# Altium schematic sheet Ethernet.SchDoc: Dahlia Carrier Board
size A3; Organization: Toradex AG; Address1: Ebenaustrasse 10; Address2: Horw; Address3: 6048; Address4: Switzerland; DocumentNumber: 7; Revision: V1.1; SheetNumber: 7; SheetTotal: 21; PageSetup: Record=PageOptions|CenterHorizontal=True|CenterVertical=True|PrintScale=0.71|XCorrection=1.00|YCorrection=1.00|PrintKind=1|BorderSize=5000000|LeftOffset=0|BottomOffset=0|Orientation=2|PaperLength=1000|PaperWidth=1000|Scale=100|PaperSource=15|PrintQuality=600|MediaType=1|DitherType=10|PaperKind=A4|PrintScaleMode=1
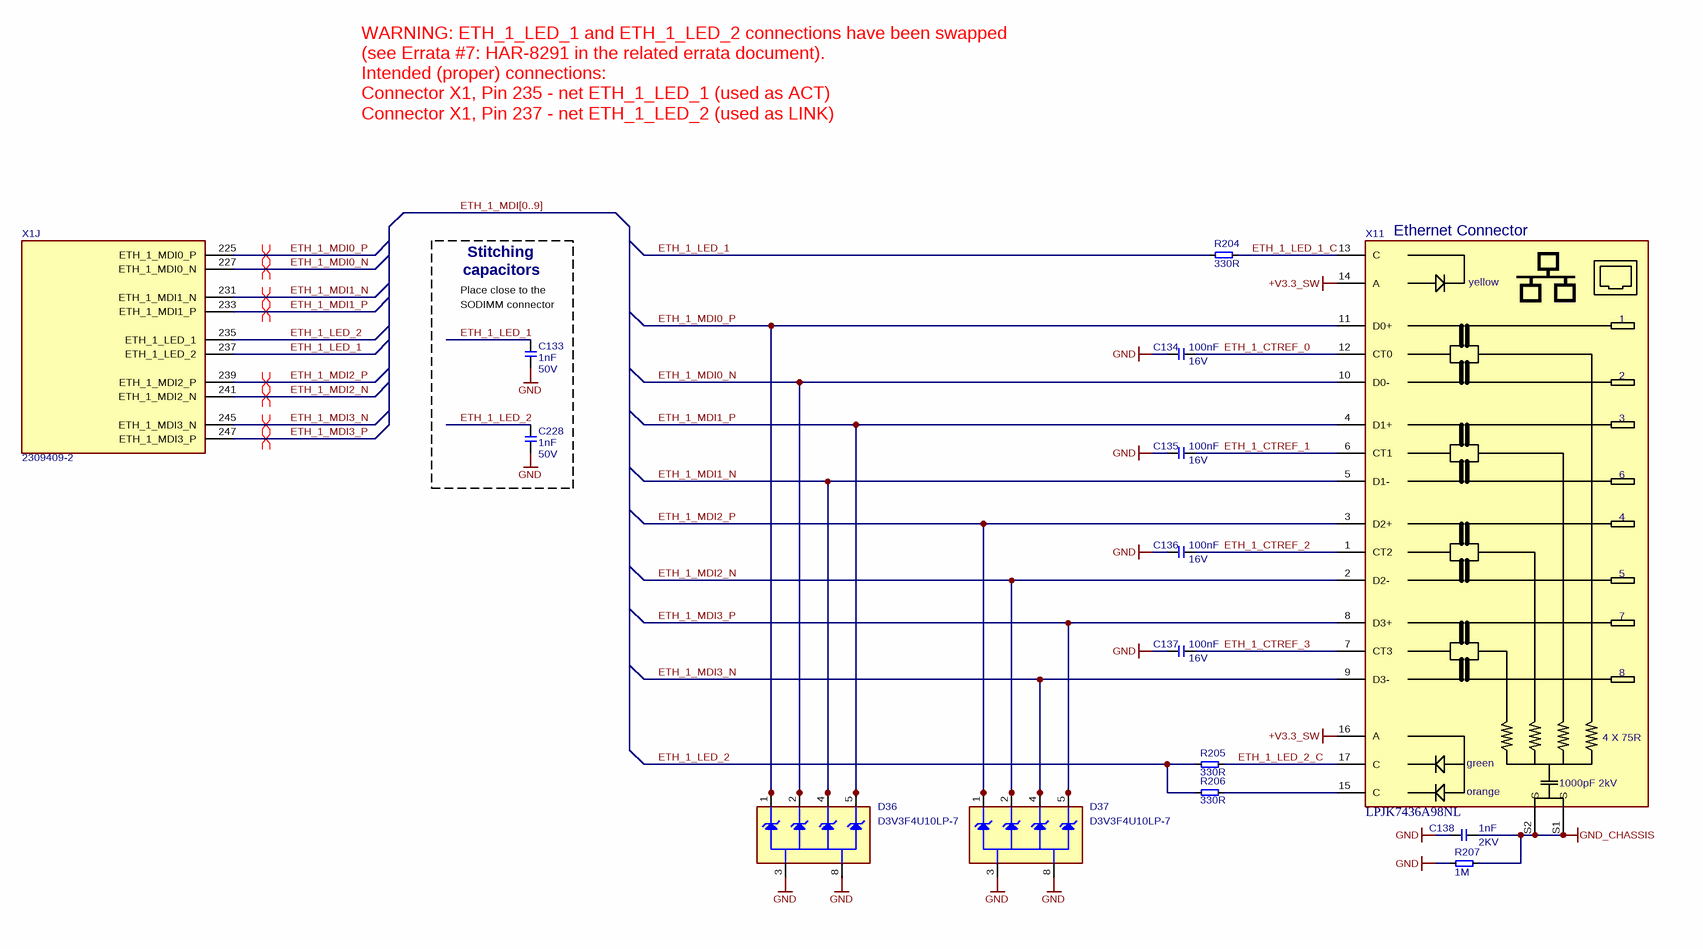
[diagram p0: Ethernet.SchDoc]

## Parts
C133  Rating: 50V  [CAPC1005X60N]  (hidden comment: 1nF)
C134  Rating: 16V  [CAPC1005X60N]  (hidden comment: 100nF)
C135  Rating: 16V  [CAPC1005X60N]  (hidden comment: 100nF)
C136  Rating: 16V  [CAPC1005X60N]  (hidden comment: 100nF)
C137  Rating: 16V  [CAPC1005X60N]  (hidden comment: 100nF)
C138  Rating: 2KV  [T_CAPC1206X180N]  (hidden comment: 1nF)
C228  Rating: 50V  [CAPC1005X60N]  (hidden comment: 1nF)
D36  D3V3F4U10LP-7  [D-Diodes-D3V3F4U10LP-7]
D37  D3V3F4U10LP-7  [D-Diodes-D3V3F4U10LP-7]
R204  330R  [RESC1005X40N]
R205  330R  [RESC1005X40N]
R206  330R  [RESC1005X40N]
R207  1M  [RESC3216X75N]
X1  2309409-2  [CON-TE-2309409-2-SOLDERABLE-STANDOFFS]  (part J of 23)
X11  LPJK7436A98NL  [CON-LINK-PP-LPJK7436A98NL]

## Nets
+V3.3_SW: X11.14(A) X11.16(A)
GND: C133.1 C134.2 C135.2 C136.2 C137.2 C138.1 C228.1 D36.3 D36.8 D37.3 D37.8 R207.2
GND_CHASSIS: C138.2 R207.1 X11.S1(S) X11.S2(S)
ETH_1_CTREF_0: C134.1 X11.12(CT0)
ETH_1_CTREF_1: C135.1 X11.6(CT1)
ETH_1_CTREF_2: C136.1 X11.1(CT2)
ETH_1_CTREF_3: C137.1 X11.7(CT3)
ETH_1_LED_1: C133.2 R204.2 X1.237(ETH_1_LED_2)
ETH_1_LED_1_C: R204.1 X11.13(C)
ETH_1_LED_2: C228.2 R205.2 R206.2 X1.235(ETH_1_LED_1)
ETH_1_LED_2_C: R205.1 X11.17(C)
ETH_1_MDI0_N: D36.2 D36.9 X1.227(ETH_1_MDI0_N) X11.10(D0-)
ETH_1_MDI0_P: D36.1 D36.10 X1.225(ETH_1_MDI0_P) X11.11(D0+)
ETH_1_MDI1_N: D36.4 D36.7 X1.231(ETH_1_MDI1_N) X11.5(D1-)
ETH_1_MDI1_P: D36.5 D36.6 X1.233(ETH_1_MDI1_P) X11.4(D1+)
ETH_1_MDI2_N: D37.2 D37.9 X1.241(ETH_1_MDI2_N) X11.2(D2-)
ETH_1_MDI2_P: D37.1 D37.10 X1.239(ETH_1_MDI2_P) X11.3(D2+)
ETH_1_MDI3_N: D37.4 D37.7 X1.245(ETH_1_MDI3_N) X11.9(D3-)
ETH_1_MDI3_P: D37.5 D37.6 X1.247(ETH_1_MDI3_P) X11.8(D3+)
NetR206_1: R206.1 X11.15(C)

## Buses and harness runs
bus ETH_1_MDI[0..9]

## Layout directives
differential pair; differential pair class LAN: ETH_1_MDI0_N, ETH_1_MDI0_P, ETH_1_MDI1_N, ETH_1_MDI1_P, ETH_1_MDI2_N, ETH_1_MDI2_P, ETH_1_MDI3_N, ETH_1_MDI3_P

## Notes on the sheet
- WARNING: ETH_1_LED_1 and ETH_1_LED_2 connections have been swapped (see Errata #7: HAR-8291 in the related errata document).
  Intended (proper) connections:
  Connector X1, Pin 235 - net ETH_1_LED_1 (used as ACT)
  Connector X1, Pin 237 - net ETH_1_LED_2 (used as LINK)
- (near X11) Ethernet Connector
- (near C133) Place close to the
- (near C133) SODIMM connector
- capacitors
- Stitching
- Title
- Size:
- Date:
- A3
- Number:
- Time:
- Revision:
- Sheet
- of
- File:
- (in symbol CON-ETH-RJ45-1000BaseT) yellow; 4 X 75R; green; 1000pF 2kV; orange

## Library data of the parts
C133 C228 = C-X7R-1nF-50V-10%-0402: Capacitor Ceramic X7R 1nF 50V 10% 0402; Tolerance: 10%; Type: X7R; Value: 1nF
C134-C137 = C-X7R-100nF-16V-10%-0402: Capacitor Ceramic X7R 100nF 16V 10% 0402; Tolerance: 10%; Type: X7R; Value: 100nF
C138 = C-X7R-1nF-2KV-10%-1206: Capacitor Ceramic X7R 1nF 2KV 10% 1206; Tolerance: 10%; Type: X7R; Value: 1nF
D36 D37 = D-Diodes-D3V3F4U10LP-7: 4 CHANNEL LOW CAPACITANCE TVS DIODE ARRAY; Manufacturer Name: Nexperia; Manufacturer Part No.: D3V3F4U10LP-7
R204-R206 = R-330R-63mW-5%-0402: Resistor 330 ohm 63mW 5% 0402; Rating: 63mW; Tolerance: 5%; Value: 330R
R207 = R-1M-250mW-5%-1206: Resistor 1 Mohm 250mW 5% 1206; Rating: 250mW; Tolerance: 5%; Value: 1M
X1 = CON-TE-2309409-2: DDR4 SODIMM Socket, 260 pins, 5.2mm(H), 0.5mm Pitch; Manufacturer Name: TE; Temperature Range: -40C to +125C; Package: DDR4-SODIMM-260; Manufacturer Part No.: 2309409-2
X11 = CON-ETH-RJ45-1000BaseT: 10/100/1000 MBit/s Gigabit Ethernet RJ45 Connector, Low profile, Mag Jack, Temp. Range: -40C to +100C; Manufacturer Name: LINK-PP; Temperature Range: *; Manufacturer Part No.: LPJK7436A98NL